# Altium schematic sheet 04_Mechanical.SchDoc: Mechanicals
size A; Revision: A; SheetNumber: 4; SheetTotal: 4; ECE315_Project_Name: ECE453 Base Project
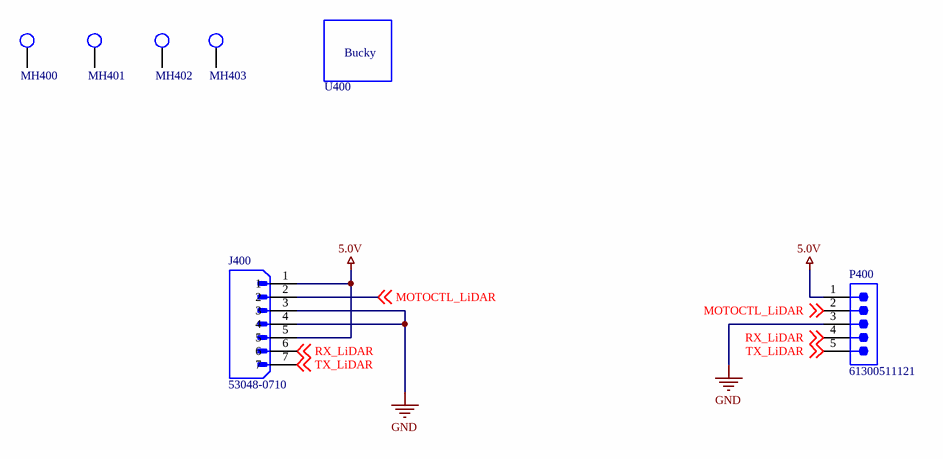
[diagram p0: 04_Mechanical.SchDoc]

## Parts
J400  53048-0710  [MOLEX_530480710]
MH400  MHOLE_2_55MM  [MHOLE_2_55MM]  (value not drawn)
MH401  MHOLE_2_55MM  [MHOLE_2_55MM]  (value not drawn)
MH402  MHOLE_2_55MM  [MHOLE_2_55MM]  (value not drawn)
MH403  MHOLE_2_55MM  [MHOLE_2_55MM]  (value not drawn)
P400  61300511121  [61300511121]
U400  Bucky  [WalkingBucky]  (value not drawn)  (no BOM)

## Nets
5.0V: J400.1 J400.5 P400.1
GND: J400.3 J400.4 P400.3
MOTOCTL_LiDAR: J400.2 P400.2 ; off-sheet MOTOCTL_LiDAR
RX_LiDAR: J400.6 P400.4 ; off-sheet RX_LiDAR
TX_LiDAR: J400.7 P400.5 ; off-sheet TX_LiDAR

Not connected (* = marked no-connect by the designer): MH400 1; MH401 1; MH402 1; MH403 1

## Notes on the sheet
- Title:
- Size:
- A
- Project
- Rev:
- Sheet:
- of
- College of Engineering
- 1415 Engineering Drive
- Madison, WI 53706

## Library data of the parts
J400 = 53048-0710: 7-Pin 1.25mm Molex Connector; MP: 530480710; Package: None; Price: None; Value: *; Availability: Unavailable
MH400-MH403 = MHOLE_2_55MM: Mounting Holde; Manufacturer Part Number: UW MTHOLE
P400 = CMP-1502-01068-2: NexarPartId: 32855526; Operating Supply Voltage: 250V; Number of Contacts: 5; Connector Type: Male Pin; Current Rating: 3A; Contact Resistance: 20mΩ; Pitch: 2.54mm; Gender: Male; Termination: Solder; RoHS: Compliant; Lead Pitch: 2.54mm; Contact Mating Length: 5.9944mm; Number of Positions: 5; Lead Free: Lead Free; Contact Plating: Gold; Number of Pins: 5; Min Operating Temperature: -40°C; Voltage Rating: 250V; Color: Black; Mount: Through Hole; REACH SVHC: Unknown; Packaging: Bulk; Height: 8.89mm; Number of Rows: 1; Orientation: Vertical; Contact Material: Copper; Max Operating Temperature: 105°C
U400 = Bucky: Bucky Badger Image; Manufacturer Part Number: UW Bucky